# Altium schematic sheet S7CAS-PLEIADES-CARTE-MERE_Pxx_FPGA_bank2_3_4.SchDoc
size Tabloid; SheetNumber: 4; SheetTotal: 15; Sheet_Name: Insert name in Document Parameters; Size: 11x17
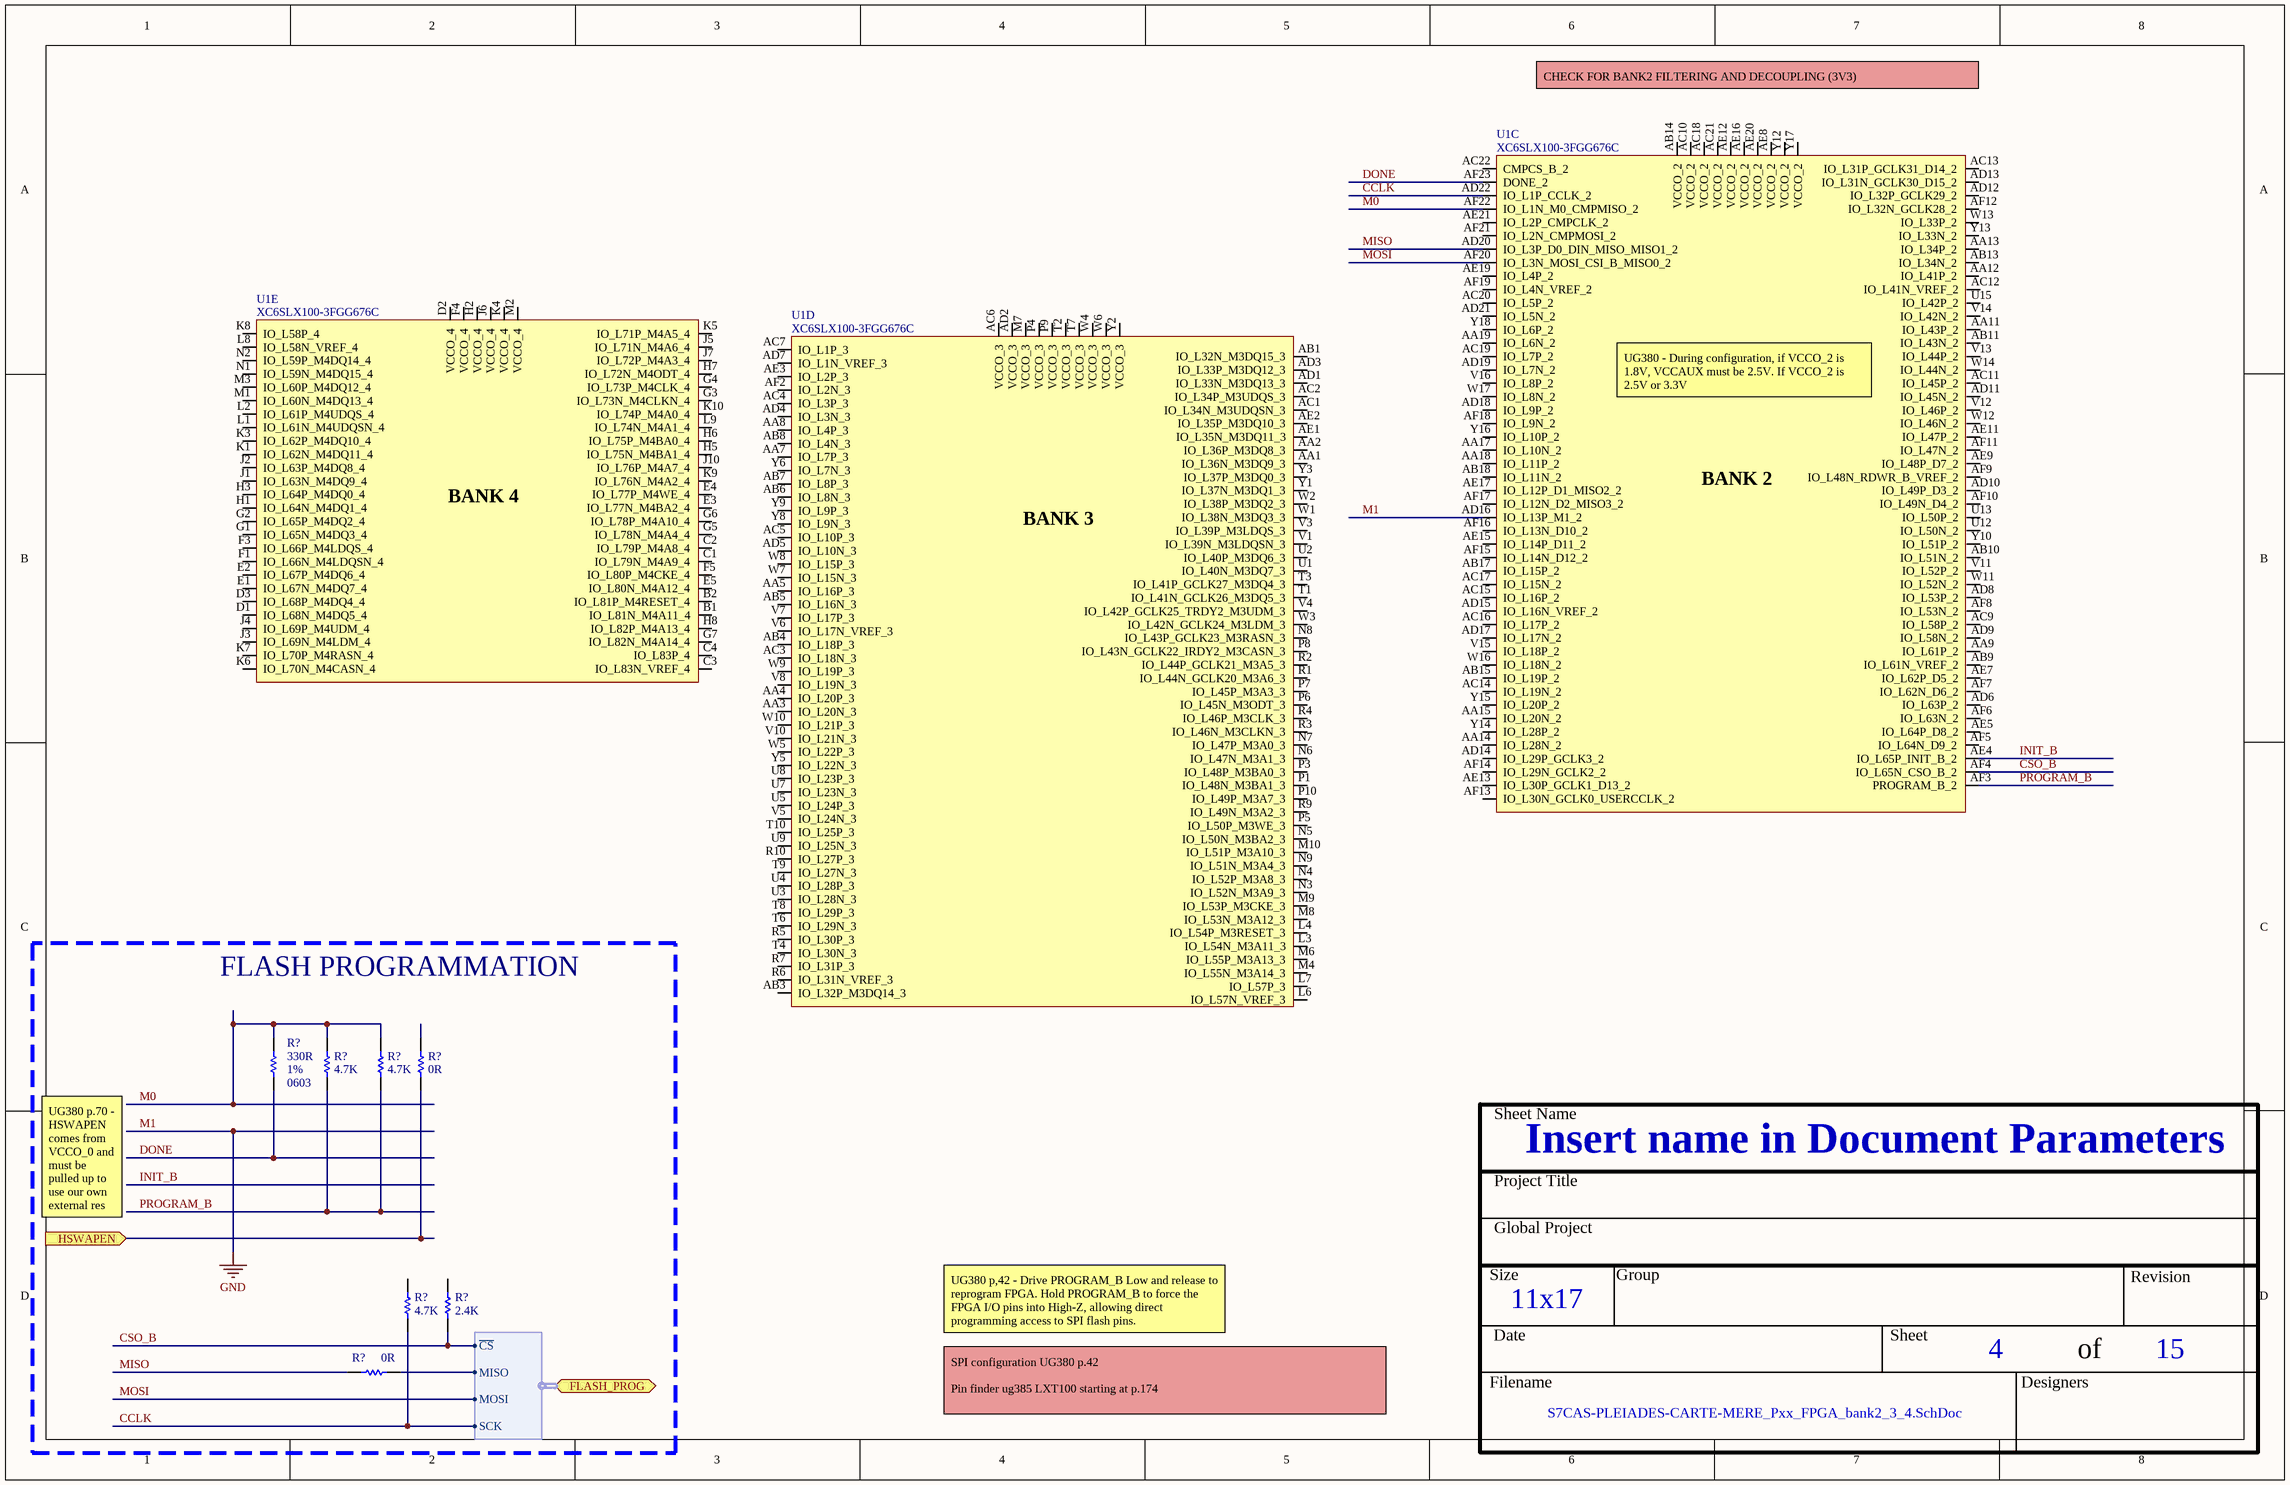
[diagram p0: S7CAS-PLEIADES-CARTE-MERE_Pxx_FPGA_bank2_3_4.SchDoc]

## Parts
(Parts that share a designator on the sheet are numbered #1, #2 ... from top to bottom, then left to right.)
R?#1  value 330R  Package: 0603  Precision: 1%  [RES_0603]  (hidden comment: RES - 0603)
R?#2  value 4.7K  [RES_0603]  (hidden comment: RES - 0603)
R?#3  value 4.7K  [RES_0603]  (hidden comment: RES - 0603)
R?#4  value 0R  [RES_0603]  (hidden comment: RES - 0603)
R?#5  value 4.7K  [RES_0603]  (hidden comment: RES - 0603)
R?#6  value 2.4K  [RES_0603]  (hidden comment: RES - 0603)
R?#7  value 0R  [RES_0603]  (hidden comment: RES - 0603)
U1  XC6SLX100-3FGG676C  [FPGA_XILINX_FGG676]  (parts C,D,E of 10)

## Blocks framed on the sheet
FLASH PROGRAMMATION: R?#1-R?#7

## Ports
FLASH_PROG (bidir, harness FLASH_PROG, see S7CAS-PLEIADES-CARTE-MERE_Pxx_FLASH_PHY_CLOCK[3D]), HSWAPEN (in, see S7CAS-PLEIADES-CARTE-MERE_Pxx_FPGA_bank0_1_5[1A])

## Harnesses
FLASH_PROG: MISO, MOSI, SCK, ~{CS}

## Nets
M1: U1.AD16(IO_L13P_M1_2)  [also labelled GND]
CCLK: R?#5.1 U1.AD22(IO_L1P_CCLK_2) ; port FLASH_PROG.SCK
CSO_B: R?#6.1 U1.AF4(IO_L65N_CSO_B_2) ; port FLASH_PROG.~{CS}
DONE: R?#1.1 U1.AF23(DONE_2)
HSWAPEN: R?#4.2 ; port HSWAPEN
INIT_B: U1.AE4(IO_L65P_INIT_B_2)
M0: R?#1.2 R?#2.2 R?#3.2 U1.AF22(IO_L1N_M0_CMPMISO_2)
MISO: R?#7.2 U1.AD20(IO_L3P_D0_DIN_MISO_MISO1_2)
MOSI: U1.AF20(IO_L3N_MOSI_CSI_B_MISO0_2) ; port FLASH_PROG.MOSI
PROGRAM_B: R?#2.1 R?#3.1 U1.AF3(PROGRAM_B_2)
NetR?#7_1: R?#7.1 ; port FLASH_PROG.MISO

Not connected (* = marked no-connect by the designer): R?#4 1; R?#5 2; R?#6 2; U1 AA1(IO_L36N_M3DQ9_3) AA2(IO_L36P_M3DQ8_3) AA3(IO_L20N_3) AA4(IO_L20P_3) AA5(IO_L16P_3) AA7(IO_L7P_3) AA8(IO_L4P_3) AA9(IO_L61P_2) AA11(IO_L43P_2) AA12(IO_L41P_2) AA13(IO_L34P_2) AA14(IO_L28N_2) AA15(IO_L20N_2) AA17(IO_L10N_2) AA18(IO_L11P_2) AA19(IO_L6N_2) AB1(IO_L32N_M3DQ15_3) AB3(IO_L32P_M3DQ14_3) AB4(IO_L18P_3) AB5(IO_L16N_3) AB6(IO_L8N_3) AB7(IO_L8P_3) AB8(IO_L4N_3) AB9(IO_L61N_VREF_2) AB10(IO_L51N_2) AB11(IO_L43N_2) AB13(IO_L34N_2) AB14(VCCO_2) AB15(IO_L19P_2) AB17(IO_L15P_2) AB18(IO_L11N_2) AC1(IO_L34N_M3UDQSN_3) AC2(IO_L34P_M3UDQS_3) AC3(IO_L18N_3) AC4(IO_L3P_3) AC5(IO_L10P_3) AC6(VCCO_3) AC7(IO_L1P_3) AC9(IO_L58P_2) AC10(VCCO_2) AC11(IO_L45P_2) AC12(IO_L41N_VREF_2) AC13(IO_L31P_GCLK31_D14_2) AC14(IO_L19N_2) AC15(IO_L16P_2) AC16(IO_L17P_2) AC17(IO_L15N_2) AC18(VCCO_2) AC19(IO_L7P_2) AC20(IO_L5P_2) AC21(VCCO_2) AC22(CMPCS_B_2) AD1(IO_L33N_M3DQ13_3) AD2(VCCO_3) AD3(IO_L33P_M3DQ12_3) AD4(IO_L3N_3) AD5(IO_L10N_3) AD6(IO_L63P_2) AD7(IO_L1N_VREF_3) AD8(IO_L53P_2) AD9(IO_L58N_2) AD10(IO_L49P_D3_2) AD11(IO_L45N_2) AD12(IO_L32P_GCLK29_2) AD13(IO_L31N_GCLK30_D15_2) AD14(IO_L29P_GCLK3_2) AD15(IO_L16N_VREF_2) AD17(IO_L17N_2) AD18(IO_L9P_2) AD19(IO_L7N_2) AD21(IO_L5N_2) AE1(IO_L35N_M3DQ11_3) AE2(IO_L35P_M3DQ10_3) AE3(IO_L2P_3) AE5(IO_L64P_D8_2) AE7(IO_L62P_D5_2) AE8(VCCO_2) AE9(IO_L48P_D7_2) AE11(IO_L47P_2) AE12(VCCO_2) AE13(IO_L30P_GCLK1_D13_2) AE15(IO_L14P_D11_2) AE16(VCCO_2) AE17(IO_L12P_D1_MISO2_2) AE19(IO_L4P_2) AE20(VCCO_2) AE21(IO_L2P_CMPCLK_2) AF2(IO_L2N_3) AF5(IO_L64N_D9_2) AF6(IO_L63N_2) AF7(IO_L62N_D6_2) AF8(IO_L53N_2) AF9(IO_L48N_RDWR_B_VREF_2) AF10(IO_L49N_D4_2) AF11(IO_L47N_2) AF12(IO_L32N_GCLK28_2) AF13(IO_L30N_GCLK0_USERCCLK_2) AF14(IO_L29N_GCLK2_2) AF15(IO_L14N_D12_2) AF16(IO_L13N_D10_2) AF17(IO_L12N_D2_MISO3_2) AF18(IO_L9N_2) AF19(IO_L4N_VREF_2) AF21(IO_L2N_CMPMOSI_2) B1(IO_L81N_M4A11_4) B2(IO_L81P_M4RESET_4) C1(IO_L79N_M4A9_4) C2(IO_L79P_M4A8_4) C3(IO_L83N_VREF_4) C4(IO_L83P_4) D1(IO_L68N_M4DQ5_4) D2(VCCO_4) D3(IO_L68P_M4DQ4_4) E1(IO_L67N_M4DQ7_4) E2(IO_L67P_M4DQ6_4) E3(IO_L77N_M4BA2_4) E4(IO_L77P_M4WE_4) E5(IO_L80N_M4A12_4) F1(IO_L66N_M4LDQSN_4) F3(IO_L66P_M4LDQS_4) F4(VCCO_4) F5(IO_L80P_M4CKE_4) G1(IO_L65N_M4DQ3_4) G2(IO_L65P_M4DQ2_4) G3(IO_L73N_M4CLKN_4) G4(IO_L73P_M4CLK_4) G5(IO_L78N_M4A4_4) G6(IO_L78P_M4A10_4) G7(IO_L82N_M4A14_4) H1(IO_L64N_M4DQ1_4) H2(VCCO_4) H3(IO_L64P_M4DQ0_4) H5(IO_L75N_M4BA1_4) H6(IO_L75P_M4BA0_4) H7(IO_L72N_M4ODT_4) H8(IO_L82P_M4A13_4) J1(IO_L63N_M4DQ9_4) J2(IO_L63P_M4DQ8_4) J3(IO_L69N_M4LDM_4) J4(IO_L69P_M4UDM_4) J5(IO_L71N_M4A6_4) J6(VCCO_4) J7(IO_L72P_M4A3_4) J10(IO_L76P_M4A7_4) K1(IO_L62N_M4DQ11_4) K3(IO_L62P_M4DQ10_4) K4(VCCO_4) K5(IO_L71P_M4A5_4) K6(IO_L70N_M4CASN_4) K7(IO_L70P_M4RASN_4) K8(IO_L58P_4) K9(IO_L76N_M4A2_4) K10(IO_L74P_M4A0_4) L1(IO_L61N_M4UDQSN_4) L2(IO_L61P_M4UDQS_4) L3(IO_L54N_M3A11_3) L4(IO_L54P_M3RESET_3) L6(IO_L57N_VREF_3) L7(IO_L57P_3) L8(IO_L58N_VREF_4) L9(IO_L74N_M4A1_4) M1(IO_L60N_M4DQ13_4) M2(VCCO_4) M3(IO_L60P_M4DQ12_4) M4(IO_L55N_M3A14_3) M6(IO_L55P_M3A13_3) M7(VCCO_3) M8(IO_L53N_M3A12_3) M9(IO_L53P_M3CKE_3) M10(IO_L51P_M3A10_3) N1(IO_L59N_M4DQ15_4) N2(IO_L59P_M4DQ14_4) N3(IO_L52N_M3A9_3) N4(IO_L52P_M3A8_3) N5(IO_L50N_M3BA2_3) N6(IO_L47N_M3A1_3) N7(IO_L47P_M3A0_3) N8(IO_L43P_GCLK23_M3RASN_3) N9(IO_L51N_M3A4_3) P1(IO_L48N_M3BA1_3) P3(IO_L48P_M3BA0_3) P4(VCCO_3) P5(IO_L50P_M3WE_3) P6(IO_L45N_M3ODT_3) P7(IO_L45P_M3A3_3) P8(IO_L43N_GCLK22_IRDY2_M3CASN_3) P9(VCCO_3) P10(IO_L49P_M3A7_3) R1(IO_L44N_GCLK20_M3A6_3) R2(IO_L44P_GCLK21_M3A5_3) R3(IO_L46N_M3CLKN_3) R4(IO_L46P_M3CLK_3) R5(IO_L30P_3) R6(IO_L31N_VREF_3) R7(IO_L31P_3) R9(IO_L49N_M3A2_3) R10(IO_L27P_3) T1(IO_L41N_GCLK26_M3DQ5_3) T2(VCCO_3) T3(IO_L41P_GCLK27_M3DQ4_3) T4(IO_L30N_3) T6(IO_L29N_3) T7(VCCO_3) T8(IO_L29P_3) T9(IO_L27N_3) T10(IO_L25P_3) U1(IO_L40N_M3DQ7_3) U2(IO_L40P_M3DQ6_3) U3(IO_L28N_3) U4(IO_L28P_3) U5(IO_L24P_3) U7(IO_L23N_3) U8(IO_L23P_3) U9(IO_L25N_3) U12(IO_L50N_2) U13(IO_L50P_2) U15(IO_L42P_2) V1(IO_L39N_M3LDQSN_3) V3(IO_L39P_M3LDQS_3) V4(IO_L42P_GCLK25_TRDY2_M3UDM_3) V5(IO_L24N_3) V6(IO_L17N_VREF_3) V7(IO_L17P_3) V8(IO_L19N_3) V10(IO_L21N_3) V11(IO_L52P_2) V12(IO_L46P_2) V13(IO_L44P_2) V14(IO_L42N_2) V15(IO_L18P_2) V16(IO_L8P_2) W1(IO_L38N_M3DQ3_3) W2(IO_L38P_M3DQ2_3) W3(IO_L42N_GCLK24_M3LDM_3) W4(VCCO_3) W5(IO_L22P_3) W6(VCCO_3) W7(IO_L15N_3) W8(IO_L15P_3) W9(IO_L19P_3) W10(IO_L21P_3) W11(IO_L52N_2) W12(IO_L46N_2) W13(IO_L33P_2) W14(IO_L44N_2) W16(IO_L18N_2) W17(IO_L8N_2) Y1(IO_L37N_M3DQ1_3) Y2(VCCO_3) Y3(IO_L37P_M3DQ0_3) Y5(IO_L22N_3) Y6(IO_L7N_3) Y8(IO_L9N_3) Y9(IO_L9P_3) Y10(IO_L51P_2) Y12(VCCO_2) Y13(IO_L33N_2) Y14(IO_L28P_2) Y15(IO_L20P_2) Y16(IO_L10P_2) Y17(VCCO_2) Y18(IO_L6P_2)

## Notes on the sheet
- CHECK FOR BANK2 FILTERING AND DECOUPLING (3V3)
- (near U1) UG380 - During configuration, if VCCO_2 is 1.8V, VCCAUX must be 2.5V. If VCCO_2 is 2.5V or 3.3V
- UG380 p.70 - HSWAPEN comes from VCCO_0 and must be pulled up to use our own external res
- UG380 p,42 - Drive PROGRAM_B Low and release to reprogram FPGA. Hold PROGRAM_B to force the FPGA I/O pins into High-Z, allowing direct programming access to SPI flash pins.
- SPI configuration UG380 p.42
  Pin finder ug385 LXT100 starting at p.174
- Sheet Name
- Project Title
- Global Project
- Size
- Group
- Revision
- Date
- Sheet
- of
- Filename
- Designers
- (in symbol FPGA_XC6SLX100-3FGG676C, part C) BANK 2
- (in symbol FPGA_XC6SLX100-3FGG676C, part D) BANK 3
- (in symbol FPGA_XC6SLX100-3FGG676C, part E) BANK 4

## Library data of the parts
R?#2-R?#7 = RES - 0603: Precision: 1%; Current: *; CreatedBy: Jonathan Bouchard; Package: 0603
  R?#2 R?#3 R?#5: Supplier 1: Arrow Electronics; Supplier Part Number 1: RMCF0603FT4K70
  R?#4 R?#7: Supplier 1: Arrow Electronics; Supplier Part Number 1: RMCF0603ZT0R00
  R?#6: Supplier 1: Mouser; Supplier Part Number 1: 603-RC0603FR-132K4L
U1 = FPGA_XC6SLX100-3FGG676C: FPGA - XILINX SPARTAN 6 480 I/O - BGA-676; Voltage: 1.14 V ~ 1.26 V; Current: *; Power: *; Mfg: Xilinx; Mfg Part Number: XC6SLX100-3FGG676C; HelpURL: https://www.xilinx.com/support/documentation/data_sheets/ds162.pdf; CreatedBy: Jonathan Bouchard; Temperature: 0°C ~ 85°C (TJ); Value: *; Precision: *; Package: BGA-676; Supplier 1: Digikey; Supplier Part Number 1: 122-1760-ND
R?#1 = RES - 0603: Current: *; CreatedBy: Jonathan Bouchard